# EAGLE design DigitalWave (EAGLE 8.4.0)
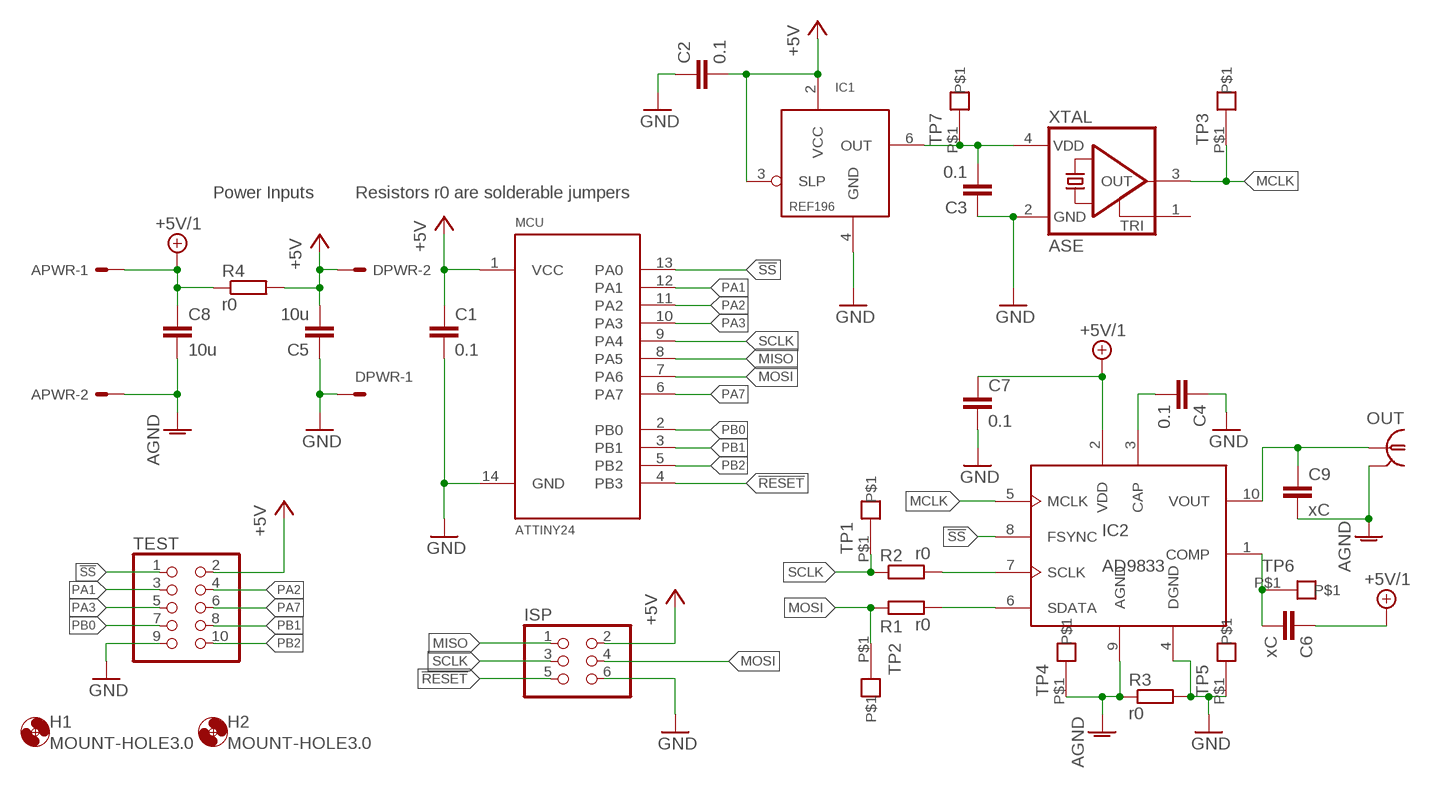
[diagram p0: schematic, sheet 1]

## Parts
APWR  22-27-2021-02  [6410-02]
C1  0.1  C-EUC0805  [C0805]
C2  0.1  C-EUC0603  [C0603]
C3  0.1  C-EUC0603  [C0603]
C4  0.1  C-EUC0603  [C0603]
C5  10u  C-EUC0805  [C0805]
C6  xC  C-EUC0805  [C0805]
C7  0.1  C-EUC0603  [C0603]
C8  10u  C-EUC0805  [C0805]
C9  xC  C-EUC0805  [C0805]
DPWR  22-27-2021-02  [6410-02]
H1  MOUNT-HOLE3.0  [3,0]
H2  MOUNT-HOLE3.0  [3,0]
IC1  REF196  REF19XS  [SO08]
IC2  AD9833  AD9833/7  [MSOP10]
ISP  PINHD-2X3  [2X03]
MCU  ATTINY24  ATTINY24ASO14  [SO14]
OUT  LTI-SASF54GT  [LTI-SASF54GT]
R1  r0  R-EU_R0402  [R0402]
R2  r0  R-EU_R0402  [R0402]
R3  r0  R-EU_R0402  [R0402]
R4  r0  R-EU_R0402  [R0402]
TEST  PINHD-2X5  [2X05]
TP1  TESTPOINT  [TESTPOINT]
TP2  TESTPOINT  [TESTPOINT]
TP3  TESTPOINT  [TESTPOINT]
TP4  TESTPOINT  [TESTPOINT]
TP5  TESTPOINT  [TESTPOINT]
TP6  TESTPOINT  [TESTPOINT]
TP7  TESTPOINT  [TESTPOINT]
XTAL  ASE  [ASE]

## Nets
3.3: C3.2 IC1.6(OUT) TP7.P$1 XTAL.4(VDD)
!RESET: ISP.5 MCU.4(PB3)
!SS: IC2.8(FSYNC) MCU.13(PA0) TEST.1
+5V: C1.1 C2.2 C5.2 DPWR.2 IC1.2(VCC) IC1.3(SLP) ISP.2 MCU.1(VCC) R4.2 TEST.2
+5V/1: APWR.1 C6.1 C7.1 C8.1 IC2.2(VDD) R4.1
AGND: APWR.2 C8.2 C9.2 IC2.9(AGND) OUT.2 OUT.3 OUT.4 OUT.5 R3.1 TP4.P$1
COMP: C6.2 IC2.1(COMP) TP6.P$1
GND: C1.2 C2.1 C3.1 C4.1 C5.1 C7.2 DPWR.1 IC1.4(GND) IC2.4(DGND) ISP.6 MCU.14(GND) R3.2 TEST.9 TP5.P$1 XTAL.2(GND)
MCLK: IC2.5(MCLK) TP3.P$1 XTAL.3(OUT)
MISO: ISP.1 MCU.8(PA5)
MOSI: ISP.4 MCU.7(PA6) R1.1 TP2.P$1
N$2: IC2.6(SDATA) R1.2
N$3: IC2.7(SCLK) R2.2
N$4: C4.2 IC2.3(CAP)
OUT: C9.1 IC2.10(VOUT) OUT.1
PA1: MCU.12(PA1) TEST.3
PA2: MCU.11(PA2) TEST.4
PA3: MCU.10(PA3) TEST.5
PA7: MCU.6(PA7) TEST.6
PB0: MCU.2(PB0) TEST.7
PB1: MCU.3(PB1) TEST.8
PB2: MCU.5(PB2) TEST.10
SCLK: ISP.3 MCU.9(PA4) R2.1 TP1.P$1
Unconnected: XTAL.1(TRI)

## Notes on the sheet
- Power Inputs | Resistors r0 are solderable jumpers

## Library data of the parts
APWR DPWR = con-molex:22-?-02: CONNECTOR wire to board 2.54 mm (.1 inch) pitch header; OC_FARNELL: unknown; OC_NEWARK: unknown
C1-C8 = resistor:C-EU: CAPACITOR, European symbol
C9 = rcl:C-EU: CAPACITOR, European symbol
H1 H2 = holes:MOUNT-HOLE: MOUNTING HOLE with drill center marker
IC1 = custom_parts:REF19X: Analog Devices 19x series voltage references
IC2 = custom_parts:AD9833/7: Analog Devices DDS Waveform generator The AD9833 is 12.5MHz (25MHz clock) the AD9837 is 8MHz (16MHz clock) both have 10 bit DACs
ISP = pinhead:PINHD-2X3: PIN HEADER
MCU = ServoShutter:ATTINY24A
OUT = con-coax:LTI-SASF54GT: SMA vertical PCB thrue hole jack Source: Lighthorse Technologies, inc. SASF54GT.pdf; OC_FARNELL: unknown; OC_NEWARK: unknown
R1-R4 = resistor:R-EU_: RESISTOR, European symbol
TEST = pinhead:PINHD-2X5: PIN HEADER
TP1-TP7 = custom_parts:TESTPOINT
XTAL = crystal:ASE: 3.3Vdc CMOS SMD CRYSTAL CLOCK OSCILLATOR SOurce: www.abracon.com; OC_FARNELL: unknown; OC_NEWARK: unknown

## Board
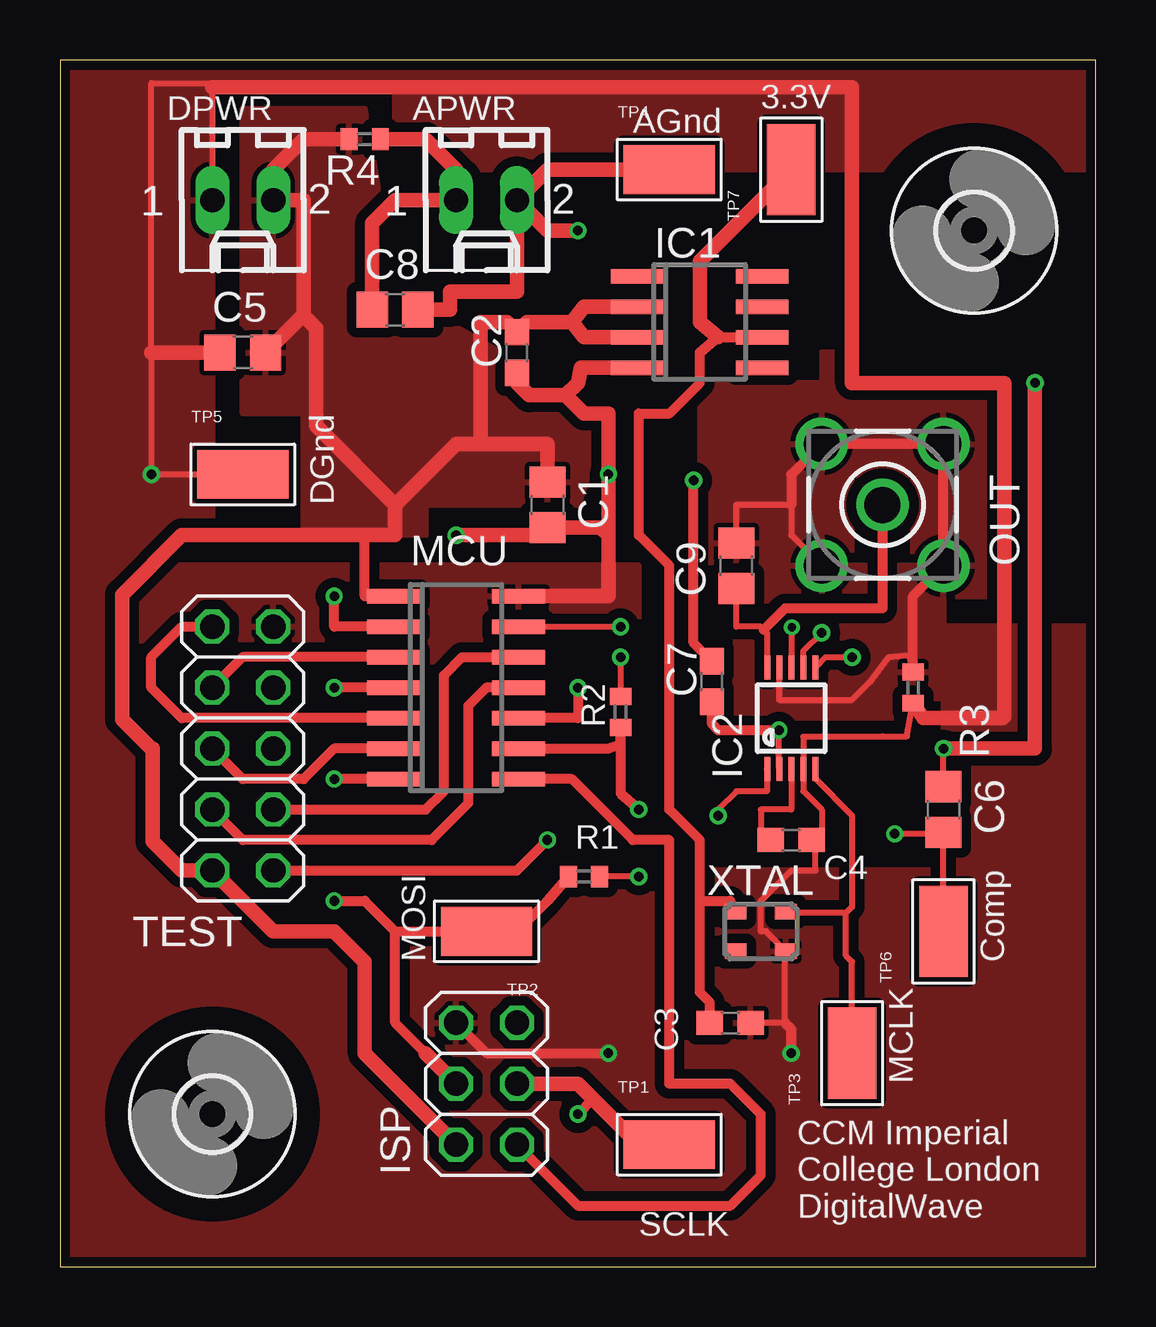
[diagram p1: board, top side]
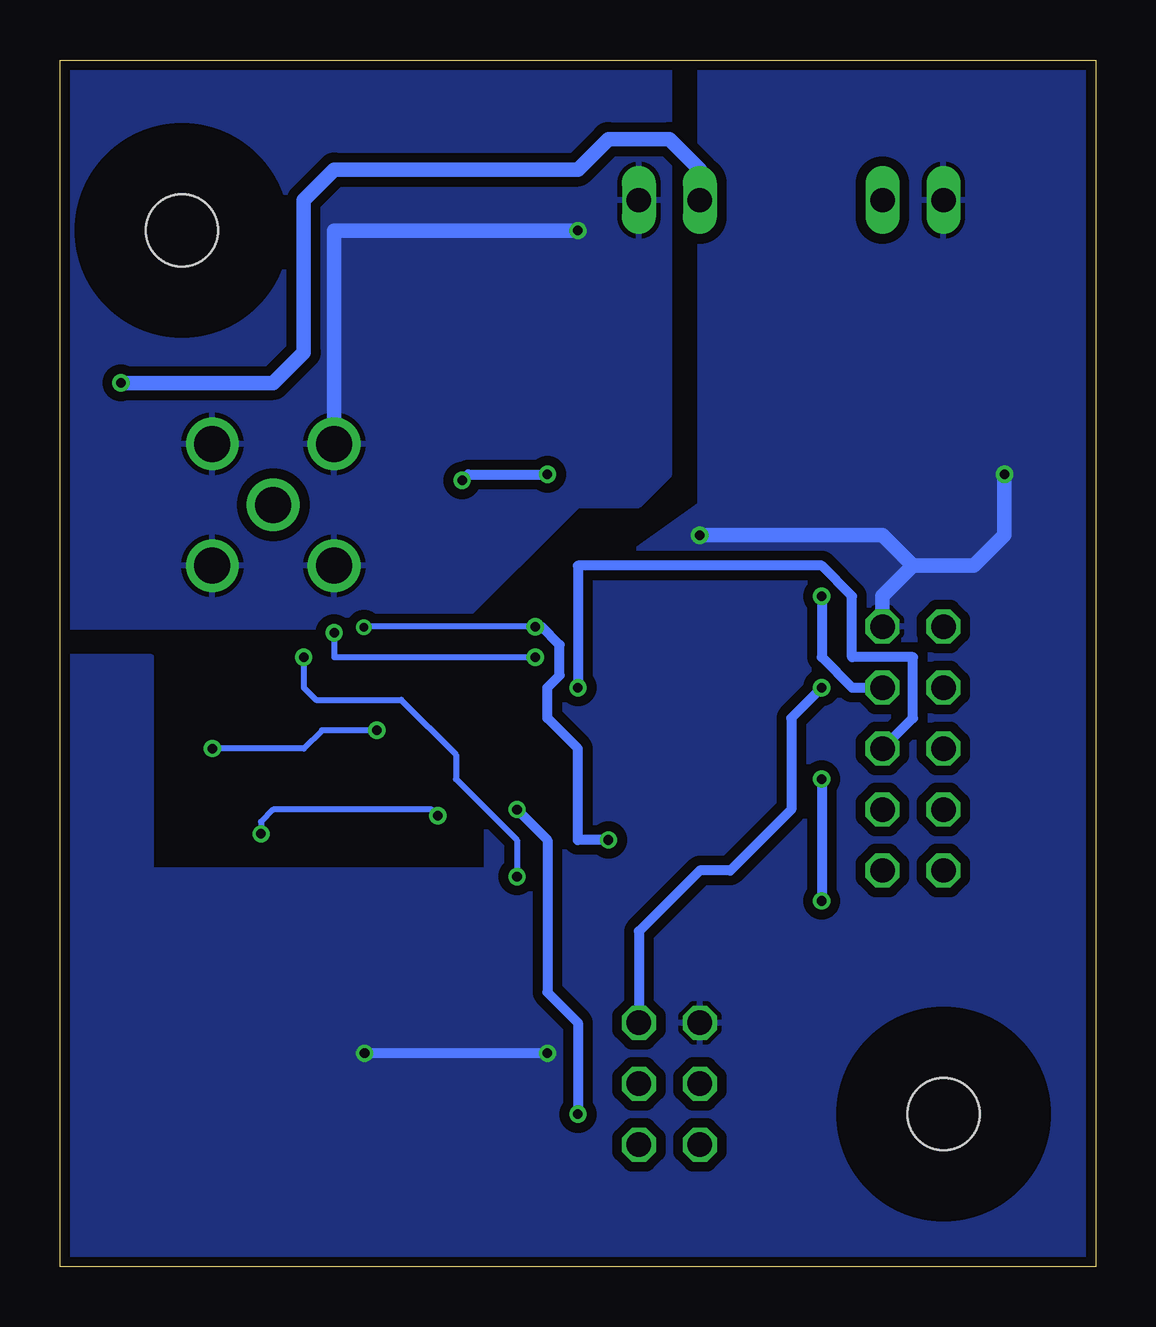
[diagram p2: board, bottom side, seen from below]

Size 43.18 x 50.29 mm. Coordinates in mm from the lower left corner, seen from the top.
Outline: 0,0 43.18,0 43.18,50.29 0,50.29 0,0
Copper layers (1*16): Top 0.035mm / dielectric 1.5mm / Bottom 0.035mm
Design rules "PCB-POOL Standard": minimum track width 0.15mm, minimum drill 0.3mm, track to track 0.15mm, track to pad 0.15mm, pad to pad 0.15mm, via to via 0.15mm, smd to smd 0.15mm, copper to edge 0.3mm, drill to drill 0.2mm, minimum pad ring 0.2mm, minimum via ring 0.15mm, stop-mask expansion 0.075mm, vias tented up to drill 0mil, thermal gap 0.2mm

### Footprints (pad centres in the part's own frame; a part is rotated, then mirrored left to right if it is on the bottom)
6410-02 = drill 1.016 long: 1 1.27,0; 2 -1.27,0
C0805 = smd 1.3 x 1.5: 1 -0.95,0; 2 0.95,0
C0603 = smd 1.1 x 1: 1 -0.85,0; 2 0.85,0
3,0 = hole 3: 0,0
SO08 = smd 0.6 x 2.2: 1 -1.905,-2.6; 2 -0.635,-2.6; 3 0.635,-2.6; 4 1.905,-2.6; 5 1.905,2.6; 6 0.635,2.6; 7 -0.635,2.6; 8 -1.905,2.6
MSOP10 = smd 0.25 x 1: 1 -1,-2.113; 2 -0.5,-2.113; 3 0,-2.113; 4 0.5,-2.113; 5 1,-2.113; 6 1,2.113; 7 0.5,2.113; 8 0,2.113; 9 -0.5,2.113; 10 -1,2.113
2X03 = drill 1.016 octagon: 1 -2.54,-1.27; 2 -2.54,1.27; 3 0,-1.27; 4 0,1.27; 5 2.54,-1.27; 6 2.54,1.27
SO14 = smd 0.6 x 2.2: 1 -3.81,-2.6; 2 -2.54,-2.6; 3 -1.27,-2.6; 4 0,-2.6; 5 1.27,-2.6; 6 2.54,-2.6; 7 3.81,-2.6; 8 3.81,2.6; 9 2.54,2.6; 10 1.27,2.6; 11 0,2.6; 12 -1.27,2.6; 13 -2.54,2.6; 14 -3.81,2.6
LTI-SASF54GT = drill 1.5 pad 2.2: 1 0,0; 2 -2.54,2.54; 3 2.54,2.54; 4 2.54,-2.54; 5 -2.54,-2.54
R0402 = smd 0.7 x 0.9: 1 -0.65,0; 2 0.65,0
2X05 = drill 1.016 octagon: 1 -5.08,-1.27; 2 -5.08,1.27; 3 -2.54,-1.27; 4 -2.54,1.27; 5 0,-1.27; 6 0,1.27; 7 2.54,-1.27; 8 2.54,1.27; 9 5.08,-1.27; 10 5.08,1.27
TESTPOINT = smd 3.81 x 2.032: P$1 0,0
ASE = smd 0.9 x 0.65: 1 -1.05,-0.825; 2 1.05,-0.825; 3 1.05,0.825; 4 -1.05,0.825

### Placement (x,y rotation side)
APWR  17.78,44.45 180 top
C1  20.32,31.75 270 top
C2  19.05,38.1 90 top
C3  27.94,10.16 180 top
C4  30.48,17.78 180 top
C5  7.62,38.1 0 top
C6  36.83,19.05 270 top
C7  27.18,24.38 90 top
C8  13.97,39.88 0 top
C9  28.19,29.21 90 top
DPWR  7.62,44.45 180 top
H1  6.35,6.35 0 top
H2  38.1,43.18 0 top
IC1  26.67,39.37 270 top
IC2  30.48,22.86 0 top
ISP  17.78,7.62 90 top
MCU  16.51,24.13 270 top
OUT  34.29,31.75 180 top
R1  21.84,16.26 0 top
R2  23.37,23.11 90 top
R3  35.56,24.13 270 top
R4  12.7,46.99 180 top
TEST  7.62,21.59 90 top
TP1  25.4,5.08 0 top
TP2  17.78,13.97 180 top
TP3  33.02,8.89 90 top
TP4  25.4,45.72 0 top
TP5  7.62,33.02 0 top
TP6  36.83,13.97 90 top
TP7  30.48,45.72 90 top
XTAL  29.21,13.97 0 top

### Tracks (layer width: path | path; a pad name or v marks a point on that pad's centre or on a via)
3.3
  Top 0.406: C3.2 27.09,11.01 26.67,11.43 26.67,15.24 | 26.67,15.24 27.94,15.24 27.94,15.02 XTAL.4 | 26.67,15.24 26.67,17.78 25.4,19.05 25.4,29.21 24.13,30.48 24.13,35.56 25.4,35.56 26.67,36.83 26.67,38.1 27.43,38.73 IC1.6
  Top 0.61: 27.43,38.73 26.67,39.37 26.67,41.91 TP7.P$1
!RESET  (via drill 0.4)
  Top 0.406: MCU.4 v11.43,24.13
  Bottom 0.406: v11.43,24.13 12.7,22.86 12.7,19.05 15.24,16.51 16.51,16.51 19.05,13.97 ISP.5
!SS  (via drill 0.35, 0.4)
  Top 0.254: MCU.13 v23.37,26.67 | v30.51,26.64 30.48,26.61 IC2.8
  Top 0.406: TEST.1 19.05,16.51 v20.32,17.78
  Bottom 0.254: v23.37,26.67 30.48,26.67 v30.51,26.64
  Bottom 0.406: v20.32,17.78 21.59,17.78 21.59,21.59 22.86,22.86 22.86,24.13 22.35,24.64 22.35,25.91 23.11,26.67 v23.37,26.67
+5V
  Top 0.406: MCU.1 12.7,27.94 12.7,30.48
  Top 0.61: C1.1 20.32,34.29 17.53,34.29 | 17.53,34.29 16.51,34.29 13.97,31.75 | 13.97,31.75 13.97,30.48 12.7,30.48 5.08,30.48 2.59,27.99 2.59,22.81 3.81,21.59 3.86,21.59 3.86,17.73 5.08,16.51 TEST.2 8.89,13.97 11.43,13.97 12.7,12.7 12.7,8.89 ISP.2 | R4.2 10.16,46.99 8.89,45.72 DPWR.2 10.16,44.45 10.16,39.69 10,39.53 | C5.2 10,39.53 | IC1.3 21.84,38.73 21.34,39.37 | 21.34,39.37 19.47,39.37 C2.2 18.63,39.37 17.53,39.37 17.53,34.29 | 10,39.53 10.25,39.53 10.67,39.12 10.67,35.05 13.97,31.75 | IC1.2 21.84,40.01 21.34,39.37
  pour Top (isolate 0.406): 7.62,48.26 12.7,48.26 13.97,40.64 22.86,35.56 21.59,31.75 15.24,31.75 15.24,30.48 10.16,30.48 10.16,35.56 7.62,35.56
+5V/1  (via drill 0.4)
  Top 0.254: IC2.2 v29.97,22.35 | C6.1 v36.83,21.59
  Top 0.406: v29.97,22.35 27.43,22.35 27.18,22.61 C7.1
  Top 0.61: R4.1 15.24,46.99 16.51,45.72 APWR.1 13.97,44.45 13.02,43.5 C8.1 | v36.83,21.59 40.64,21.59 v40.64,36.83
  Bottom 0.254: v29.97,22.35 32.26,22.35 33.02,21.59 v36.83,21.59
  Bottom 0.61: v40.64,36.83 34.29,36.83 33.02,38.1 33.02,44.45 31.75,45.72 21.59,45.72 20.32,46.99 17.78,46.99 16.51,45.72 APWR.1
AGND  (via drill 0.4)
  Top 0.254: IC2.9 29.97,23.62 33.02,23.62 33.78,24.38 34.54,25.4 35.39,25.49 R3.1 | C9.2 28.19,31.75 30.48,31.75 30.48,30.48 OUT.3
  Top 0.406: R3.1 35.56,27.94 OUT.2 OUT.5 OUT.4 30.48,33.02 30.48,31.75
  Top 0.61: TP4.P$1 20.32,45.72 APWR.2 | APWR.2 19.05,40.64 16.26,40.64 16.26,39.88 C8.2 | APWR.2 20.32,43.18 v21.59,43.18
  Bottom 0.61: v21.59,43.18 31.75,43.18 OUT.4
  pour Top (isolate 0.406): 26.67,36.83 26.67,29.21 30.48,29.21 30.48,27.94 33.02,27.94 33.02,33.02 35.56,33.02 35.56,27.94 40.64,27.94 40.64,38.1 31.75,38.1 31.75,36.83
  pour Bottom (isolate 0.406): 17.78,51.05 43.18,51.05 43.18,26.67 26.67,26.67 21.59,31.75 19.05,31.75 17.78,33.02
  pour Top (isolate 0.406): 26.67,29.21 36.83,29.21 36.83,22.86 26.67,22.86
COMP  (via drill 0.4)
  Top 0.254: IC2.1 29.46,20.73 29.46,19.81 28.19,19.81 27.43,19.05 v27.43,18.8 | 36.76,18.03 v34.8,18.03 | 36.76,18.03 C6.2 | TP6.P$1 36.83,17.97 36.76,18.03
  Bottom 0.254: v27.43,18.8 27.69,19.05 34.29,19.05 34.8,18.54 v34.8,18.03
GND  (via drill 0.4)
  Top 0.254: TP5.P$1 v3.81,33.02 3.81,38.1 3.81,49.33 6.35,49.33 6.35,49.15 DPWR.1 | R3.2 35.47,23.03 35.31,22.1 34.29,22.1 30.98,22.09 IC2.4 30.98,19.82 31.75,19.05 31.75,17.78 31.5,17.78 | 31.5,17.78 C4.1 | 31.5,17.78 31.5,16.51 30.48,16.51 29.21,15.24 29.21,13.97 29.43,13.97 XTAL.2 30.23,13.11 30.23,10.16 C3.1
  Top 0.406: ISP.6 17.78,8.89 v22.86,8.89 | v30.48,8.89 30.48,9.91 30.23,10.16 | C7.2 26.42,26 v26.42,32.77
  Top 0.61: MCU.14 22.86,27.94 22.86,30.48 | 22.86,30.48 22.54,30.8 C1.2 20.32,30.48 v16.51,30.48 | IC1.4 21.72,37.47 21.59,36.83 21.08,36.32 | 21.08,36.32 19.56,36.32 19.05,36.83 C2.1 | 22.86,30.48 v22.86,33.02 22.86,35.56 21.84,35.56 21.08,36.32 | C5.1 3.81,38.1 | R3.2 35.98,22.86 39.3,22.86 39.37,22.93 39.37,36.83 33.02,36.83 33.02,49.15 6.35,49.15
  Bottom 0.406: v22.86,8.89 v30.48,8.89 | v26.42,32.77 26.16,33.02 v22.86,33.02
  Bottom 0.61: TEST.9 8.89,27.94 7.62,29.21 | 7.62,29.21 5.08,29.21 3.81,30.48 v3.81,33.02 | 7.62,29.21 8.89,30.48 v16.51,30.48
  pour Top (isolate 0.406): 0,50.04 43.18,50.04 43.18,45.72 13.97,45.72 13.97,49.53 6.35,49.53 6.35,29.21 0,29.21
  pour Top (isolate 0.406): 0,29.21 0,0 43.18,0 43.18,26.67 36.83,26.67 36.83,16.51 24.13,16.51 24.13,29.21
  pour Bottom (isolate 0.406): 0,50.04 16.51,50.04 16.51,31.75 25.4,25.4 25.4,16.51 39.37,16.51 39.37,25.4 43.18,25.4 43.18,0 0,0
MCLK
  Top 0.254: IC2.5 31.48,20.34 33.02,18.8 33.02,14.99 32.77,14.73 | XTAL.3 30.32,14.73 32.77,14.73 | TP3.P$1 33.02,12.7 32.77,12.95 32.77,14.73
MISO
  Top 0.406: ISP.1 21.59,2.54 27.94,2.54 29.21,3.81 29.21,6.35 27.94,7.62 25.4,7.62 25.4,17.78 23.88,17.78 21.34,20.32 MCU.8
MOSI  (via drill 0.4)
  Top 0.406: 15.24,8.89 13.97,10.16 13.97,13.97 | v11.43,15.24 12.7,15.24 13.97,13.97 | MCU.7 v11.43,20.32 | 13.97,13.97 TP2.P$1 19.05,13.97 20.32,15.24 R1.1
  Top 0.61: ISP.4 15.24,8.89
  Bottom 0.406: v11.43,20.32 v11.43,15.24
N$2  (via drill 0.4)
  Top 0.254: IC2.6 31.91,25.4 v33.02,25.4 | v24.13,16.26 R1.2
  Bottom 0.254: v33.02,25.4 33.02,24.13 32.51,23.62 28.96,23.62 26.67,21.34 26.67,20.32 24.13,17.78 v24.13,16.26
N$3  (via drill 0.4)
  Top 0.254: IC2.7 30.99,24.98 30.99,25.65 v31.75,26.42 | v23.37,25.4 R2.2
  Bottom 0.254: v31.75,26.42 31.75,25.4 v23.37,25.4
N$4
  Top 0.254: IC2.3 30.48,19.05 29.21,19.05 29.21,18.2 C4.2
OUT
  Top 0.254: IC2.10 29.48,26.4 29.34,26.54 29.21,26.67 28.19,26.67 C9.1
  Top 0.406: OUT.1 34.29,27.43 30.23,27.43 29.34,26.54
PA1
  Top 0.406: TEST.3 15.24,19.05 16,19.81 16,24.64 16.76,25.4 MCU.12
PA2
  Top 0.406: MCU.11 17.78,24.13 17.02,23.37 17.02,19.3 15.49,17.78 7.62,17.78 TEST.4
PA3  (via drill 0.4)
  Top 0.406: v21.59,24.13 21.59,22.86 MCU.10
  Bottom 0.406: TEST.5 7.62,22.86 7.62,25.4 10.16,25.4 10.16,27.94 11.43,29.21 21.59,29.21 v21.59,24.13
PA7
  Top 0.406: MCU.6 11.43,21.59 10.16,20.32 7.62,20.32 TEST.6
PB0  (via drill 0.4)
  Top 0.406: MCU.2 11.43,26.67 v11.43,27.94
  Bottom 0.406: v11.43,27.94 11.43,25.4 10.16,24.13 TEST.7
PB1
  Top 0.406: MCU.3 7.62,25.4 TEST.8
PB2
  Top 0.406: MCU.5 5.08,22.86 3.81,24.13 3.81,25.4 5.08,26.67 TEST.10
SCLK  (via drill 0.4)
  Top 0.406: MCU.9 22.86,21.59 23.37,21.76 R2.1 23.37,19.72 v24.13,19.05 | v21.59,6.35 22.22,6.99
  Top 0.61: ISP.3 21.59,7.62 22.22,6.99 24.13,5.08 TP1.P$1
  Bottom 0.406: v24.13,19.05 22.86,17.78 22.86,11.43 21.59,10.16 v21.59,6.35

### Text on the board
tNames: 3.3V | AGnd | DGnd | MOSI | Comp | MCLK | CCM Imperial / College London / DigitalWave | SCLK
tValues: PB2 | DGnd | PB1 | PB0 | PA7 | PA3 | PA2 | PA1 | D5V | !SS | +5V